# Altium schematic sheet esp32_radio_sch.SchDoc
size A3
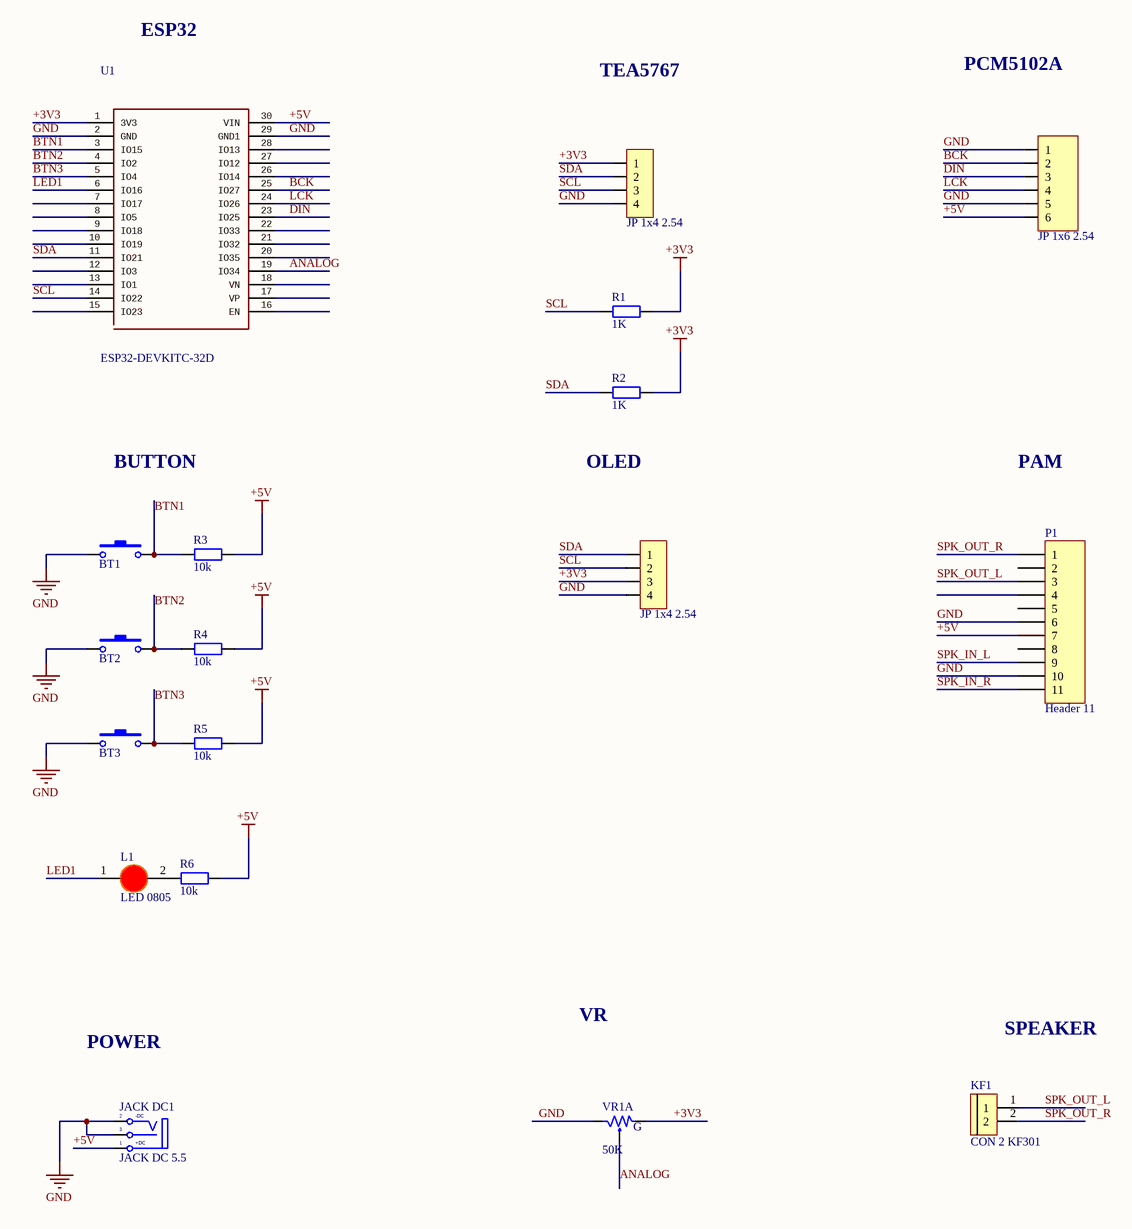
[diagram p0: esp32_radio_sch.SchDoc]

## Parts
BT1  Nut Nhan 2 Chan SMD 3x6x2.5  [Nut Nhan 2 Chan SMD 3x6x2.5]  (value not drawn)
BT2  Nut Nhan 2 Chan SMD 3x6x2.5  [Nut Nhan 2 Chan SMD 3x6x2.5]  (value not drawn)
BT3  Nut Nhan 2 Chan SMD 3x6x2.5  [Nut Nhan 2 Chan SMD 3x6x2.5]  (value not drawn)
JACK_DC1  JACK DC 5.5  [JACK DC 5.5]
JP1  JP 1x6 2.54  [JP 1x6 CT]
JP2  JP 1x4 2.54  [JP 1x4 CC]
JP3  JP 1x4 2.54  [JP 1x4 CT]
KF1  CON 2 KF301  [Con 2 KF301 5.08]
L1  LED 0805  [LED-0805-Red]
P1  Header 11  [HDR1X11]
R1  1K  [tro smd 0805]
R2  1K  [tro smd 0805]
R3  10k  [tro smd 0805]
R4  10k  [tro smd 0805]
R5  10k  [tro smd 0805]
R6  10k  [tro smd 0805]
U1  ESP32-DEVKITC-32D  [MODULE_ESP32-DEVKITV1]
VR1  50K  [VR-D1]  (part A of 2)

## Nets
+3V3: JP2.1 JP3.3 R1.2 R2.2 U1.1(3V3) VR1.1
+5V: JACK_DC1.1(T) JP1.6 P1.7 R3.2 R4.2 R5.2 R6.2 U1.30(VIN)
GND: BT1.1 BT2.1 BT3.1 JACK_DC1.2(TN) JACK_DC1.3(S) JP1.1 JP1.5 JP2.4 JP3.4 P1.6 P1.10 U1.2(GND) U1.29(GND1) VR1.3
ANALOG: U1.19(IO34) VR1.2
BCK: JP1.2 U1.25(IO27)
BTN1: BT1.2 R3.1 U1.3(IO15)
BTN2: BT2.2 R4.1 U1.4(IO2)
BTN3: BT3.2 R5.1 U1.5(IO4)
DIN: JP1.3 U1.23(IO25)
LCK: JP1.4 U1.24(IO26)
LED1: L1.1(A) U1.6(IO16)
SCL: JP2.3 JP3.2 R1.1 U1.14(IO22)
SDA: JP2.2 JP3.1 R2.1 U1.11(IO21)
SPK_IN_L: P1.9
SPK_IN_R: P1.11
SPK_OUT_L: KF1.1 P1.3
SPK_OUT_R: KF1.2 P1.1
NetL1_2: L1.2(K) R6.1

Not connected (* = marked no-connect by the designer): P1 2 4 5 8; U1 7(IO17) 8(IO5) 9(IO18) 10(IO19) 12(IO3) 13(IO1) 15(IO23) 16(EN) 17(VP) 18(VN) 20(IO35) 21(IO32) 22(IO33) 26(IO14) 27(IO12) 28(IO13)

## Notes on the sheet
- ESP32
- TEA5767
- PCM5102A
- BUTTON
- OLED
- PAM
- VR
- POWER
- SPEAKER
- (in symbol JACK DC 5.5) -DC; +DC
- (in symbol VR-DP, part A) G

## Library data of the parts
BT1-BT3 = Nut Nhan 2 Chan SMD 3x6x2.5: Ma_Hang: MH001036; Ten: Nút Nhấn 2 Chân 3x6x2.5MM SMD
JACK_DC1 = JACK DC 5.5: Value: Jac DC
JP1 = JP 1x6 2.54 Cai Thang: Cắm; Ten_Linh_Kien: Jump Đơn Cái 2.54MM 1x20P Thẳng; Don_Vi: Con; Ma_Hang: MH004006; Ghi_Chu: *; Kieu_Chan: *; Chung_Loai: Cắm
JP2 = JP 1x4 2.54 Cai Cong: Cắm; Ten_Linh_Kien: Jump Đơn Cái 2.54MM 1x40P Cong; Don_Vi: Con; Ma_Hang: MH001265; Ghi_Chu: *; Kieu_Chan: *; Chung_Loai: Cắm
JP3 = JP 1x4 2.54 Cai Thang: Cắm; Ten_Linh_Kien: Jump Đơn Cái 2.54MM 1x20P Thẳng; Don_Vi: Con; Ma_Hang: MH004006; Ghi_Chu: *; Kieu_Chan: *; Chung_Loai: Cắm
KF1 = CON 2 KF301: Cắm; Ma_Hang: MH000987; Ten_Linh_Kien: CON 2 KF301-2P 5.08MM Xanh Dương; Chung_Loai: Cắm; Ghi_Chu: *; Kieu_Chan: *; Don_Vi: Con
L1 = LED 0805 Do: Dán; Don_Vi: Con; Ma_Hang: MH000897; Ten_Linh_Kien: LED 0805 Màu Đỏ (Red); Ghi_Chu: *; Kieu_Chan: *; Chung_Loai: Dán
P1 = Header 11: Header, 11-Pin; LatestRevisionDate: 17-Jul-2002; LatestRevisionNote: Re-released for DXP Platform.; Publisher: Altium Limited
R1-R6 = Tro 0805 1% 1k: Dán; Don_Vi: Con; So_Chan: 2; Ten_Linh_Kien: Trở 0805 1% 1k; Ma_Hang: MH005468; Chung_Loai: Dán; Kieu_Chan: *
U1 = ESP32-DEVKITC-32D: Eval Board For Esp-Wroom-32; MF: Espressif Systems; Availability: Unavailable; Package: None; SnapEDA_Link: https://www.snapeda.com/parts/ESP32-DEVKITC-32D/Espressif%20Systems/view-part/?ref=snap; MP: ESP32-DEVKITC-32D; Price: None; Value: *
VR1 = VR-DP: Volume control Dual; Value: Volume Dual 50K